# Altium schematic sheet power_battery.SchDoc
size A4; SheetNumber: 3; SheetTotal: 4
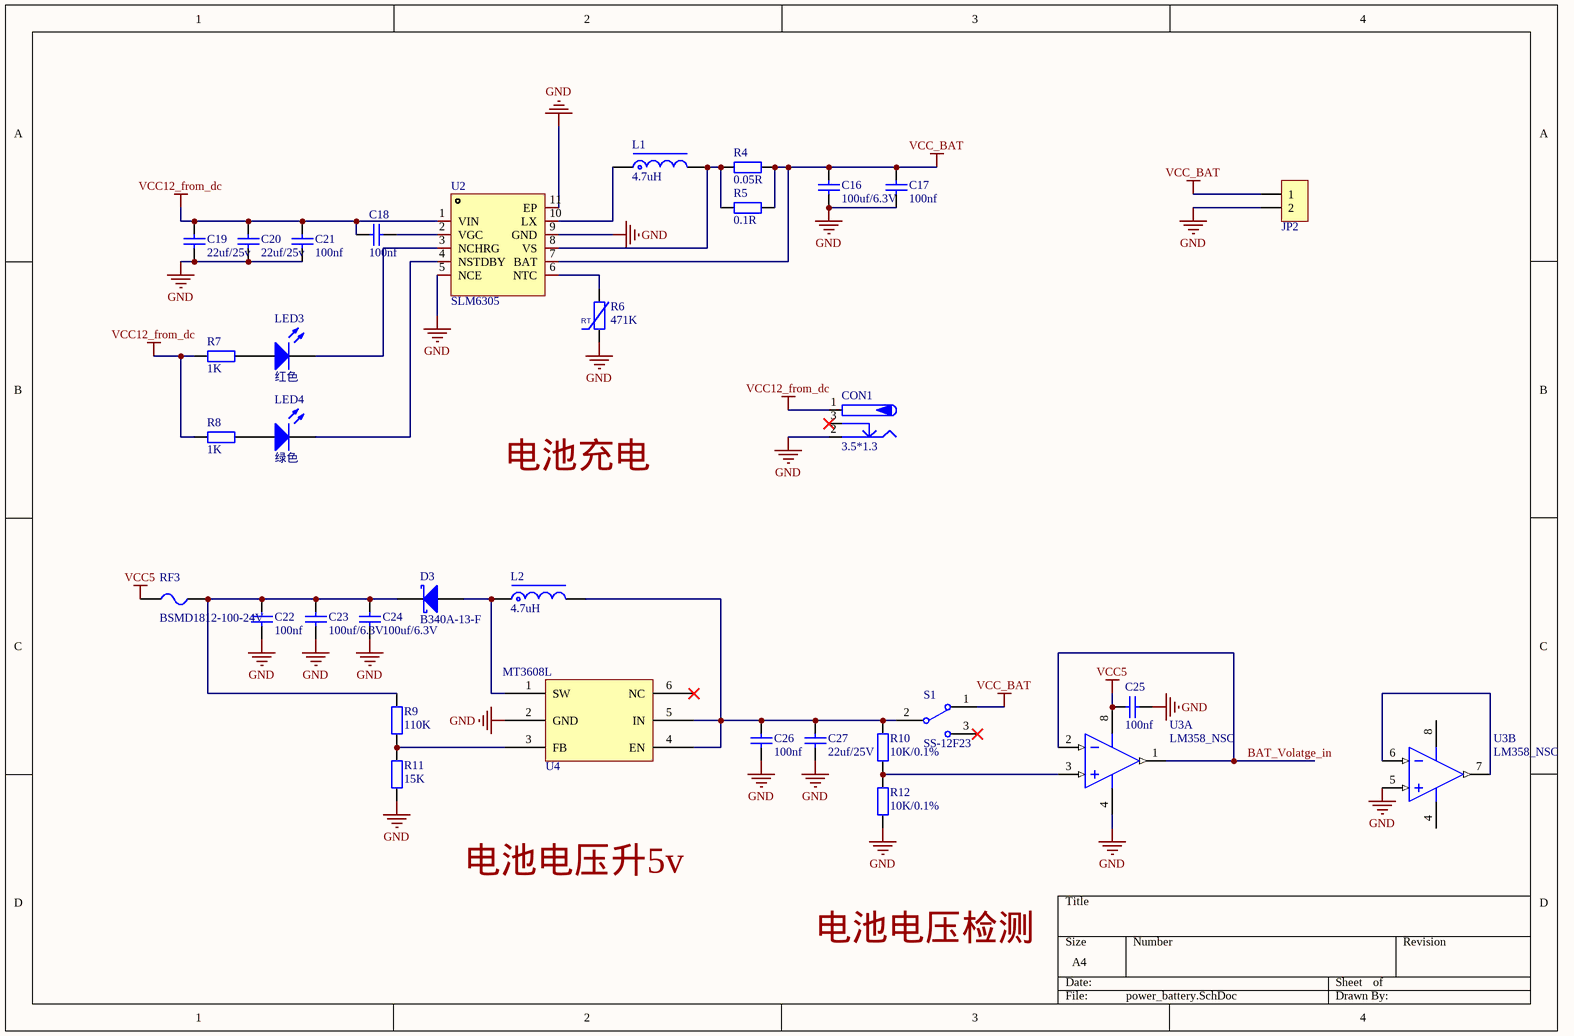
[diagram p0: power_battery.SchDoc]

## Parts
C16  100uf/6.3V  [C1206_L]
C17  100nf  [C0603_L]
C18  100nf  [C0603_L]
C19  22uf/25v  [C0805_L]
C20  22uf/25v  [C0805_L]
C21  100nf  [C0603_L]
C22  100nf  [C0603_L]
C23  100uf/6.3V  [C1206_L]
C24  100uf/6.3V  [C1206_L]
C25  100nf  [C0603_L]
C26  100nf  [C0603_L]
C27  22uf/25V  [C1206_L]
CON1  3.5*1.3  [DC-005]
D3  B340A-13-F  [SMA]
JP2  HDR-1X2  [PH2.0-L-2P]  (value not drawn)
L1  4.7uH  [CD53]
L2  4.7uH  [CD53]
LED3  红色  [LED0603_Y]
LED4  绿色  [LED0603_Y]
R4  0.05R  [R0805_M]
R5  0.1R  [R0805_M]
R6  471K  [PK0406]
R7  1K  [R0603_L]
R8  1K  [R0603_L]
R9  110K  [R0603_L]
R10  10K/0.1%  [R0603_L]
R11  15K  [R0603_L]
R12  10K/0.1%  [R0603_L]
RF3  BSMD1812-100-24V  [F1812]
S1  SS-12F23  [SS-12D10]
U2  SLM6305  [DFN10-L3.0-W3.0-P0.5_EP]
U3  LM358_NSC  [SOP8_N]  (parts A,B of 2)
U4  MT3608L  [SOT23-6M]

## Nets
GND: C16.1 C17.1 C19.1 C20.1 C21.2 C22.1 C23.1 C24.1 C25.1 C26.1 C27.1 CON1.2 JP2.2 R6.1 R11.1 R12.1 U2.5(NCE) U2.9(GND) U2.11(EP) U3.4(V-) U3.5(IN2+) U4.2(GND)
VCC5: C25.2 RF3.2 U3.8(V+)
VCC12_from_dc: C18.2 C19.2 C20.2 C21.1 CON1.1 R7.1 R8.1 U2.1(VIN)
VCC_BAT: C16.2 C17.2 JP2.1 R4.2 R5.2 S1.1 U2.7(BAT)
BAT_Volatge_in: U3.1(OUT1) U3.2(IN1-)
NetC18_1: C18.1 U2.2(VGC)
NetC22_2: C22.2 C23.2 C24.2 D3.2(K) R9.2 RF3.1
NetC26_2: C26.2 C27.2 L2.2 R10.2 S1.2 U4.4(EN) U4.5(IN)
NetD3_1: D3.1(A) L2.1 U4.1(SW)
NetL1_1: L1.1 U2.10(LX)
NetL1_2: L1.2 R4.1 R5.1 U2.8(VS)
NetLED3_1: LED3.1(A) R7.2
NetLED3_2: LED3.2(K) U2.3(NCHRG)
NetLED4_1: LED4.1(A) R8.2
NetLED4_2: LED4.2(K) U2.4(NSTDBY)
NetR6_2: R6.2 U2.6(NTC)
NetR9_1: R9.1 R11.2 U4.3(FB)
NetR10_1: R10.1 R12.2 U3.3(IN1+)
NetU3_6: U3.6(IN2-) U3.7(OUT2)

Not connected (* = marked no-connect by the designer): CON1 3*; S1 3*; U4 6(NC)*

## Notes on the sheet
- 电池充电
- 电池电压升5v
- 电池电压检测

## Library data of the parts
C16-C21 = C: 贴片电容/MLCC电容; BOM名称: 无极性贴片电容; 联系下单店铺卖家 免费帮你查找封装: 联系下单店铺卖家 免费技术指导
  C16 C19 C20: jlc_id: C45783
C22-C27 = C: 贴片电容/MLCC电容; BOM名称: 无极性贴片电容
  C23 C24: jlc_id: C15008
CON1 = DC002~DC005: 低压DC电源接口; BOM名称: DC电源接口; 当前库版本V2024.2.3 @淘宝卖家:黄晶宝石: 最新版本发布https://item.taobao.com/item.htm?id=566775463719
D3 = B340A-13-F: 肖特基二极管 C85098; 属性: 60V/5A; BOM名称: 肖特基二极管
JP2 = Header 2: 2P接插件; 封装库来自淘宝卖家：黄晶宝石: 获取最新版本https://shop463601444.taobao.com; 联系下单店铺卖家 免费帮你查找封装: 联系下单店铺卖家 免费技术支持; BOM名称: 2P接插件
L1 L2 = L-SMD: CD系列贴片线绕功率电感; BOM名称: 功率电感; jlc_id: C177246
LED3 LED4 = LED: 贴片LED; 封装库来自淘宝卖家：黄晶宝石: 其他店铺购入均为盗版封装库，无更新权益，请立即申请退款，本店现金奖励200~1000元; BOM名称: 贴片LED
R4 R5 R7-R12 = R: 贴片电阻; 联系下单店铺卖家 免费帮你查找封装: 联系下单店铺卖家 免费技术指导; BOM名称: 贴片电阻
  R4: jlc_id: C127691
  R5: jlc_id: C25334
R6 = RT: 热敏电阻; BOM名称: 压敏电阻; 当前库版本V2024.3.30 @淘宝卖家:黄晶宝石: 最新版本发布https://item.taobao.com/item.htm?id=566775463719
RF3 = FUSE-PPTC: PPTC自恢复保险丝 C910830; 当前库版本V2024.3.30 @淘宝卖家:黄晶宝石: 最新版本发布https://item.taobao.com/item.htm?id=566775463719; BOM名称: PPTC自恢复保险丝; jlc_id: C883154
S1 = SSW-1P: 1路波动开关; BOM名称: 波动开关; 联系下单店铺卖家 免费技术支持: 联系下单店铺卖家 免费帮你查找封装
U2 = SLM6305: 1锂电池充电ic 2.5a 4.2v 4V~26V输入; Manufacturer: 无锡松朗微; Add into BOM: yes; The Chip Type: 降压充电芯片; Supply Voltage: 4V~26V; Type of Battery: 锂离子/聚合物; Number of Cells: 1; Symbol: SLM6305; Device: SLM6305; Supplier: LCSC; jlc_id: C711584; Manufacturer Part: SLM6305; JLCPCB Part Class: 扩展库; LCSC Part Name: 宽输入电压2.5A单节锂电池充电管理IC; Supplier Footprint: TDFN-10-EP(3x3); Datasheet: https://atta.szlcsc.com/upload/public/pdf/source/20200723/C711584_2224278DBAF55B7B34A102BEBD70C238.pdf; Convert to PCB: yes; Maximum Charge Current: 2.5A; Charging Saturation Voltage: 4.2V; Operating Temperature: -40℃~+85℃
U3 = LM358_NSC: Fast Settling Dual Operational Amplifier; 联系卖家 免费查找封装: 唯一出售店铺网址https://shop463601444.taobao.com; jlc_id: C2923376
U4 = MT3608L: Boost升压DC-DC芯片 2-28V